# EAGLE design gate-controller-V2 (EAGLE 7.6.0)
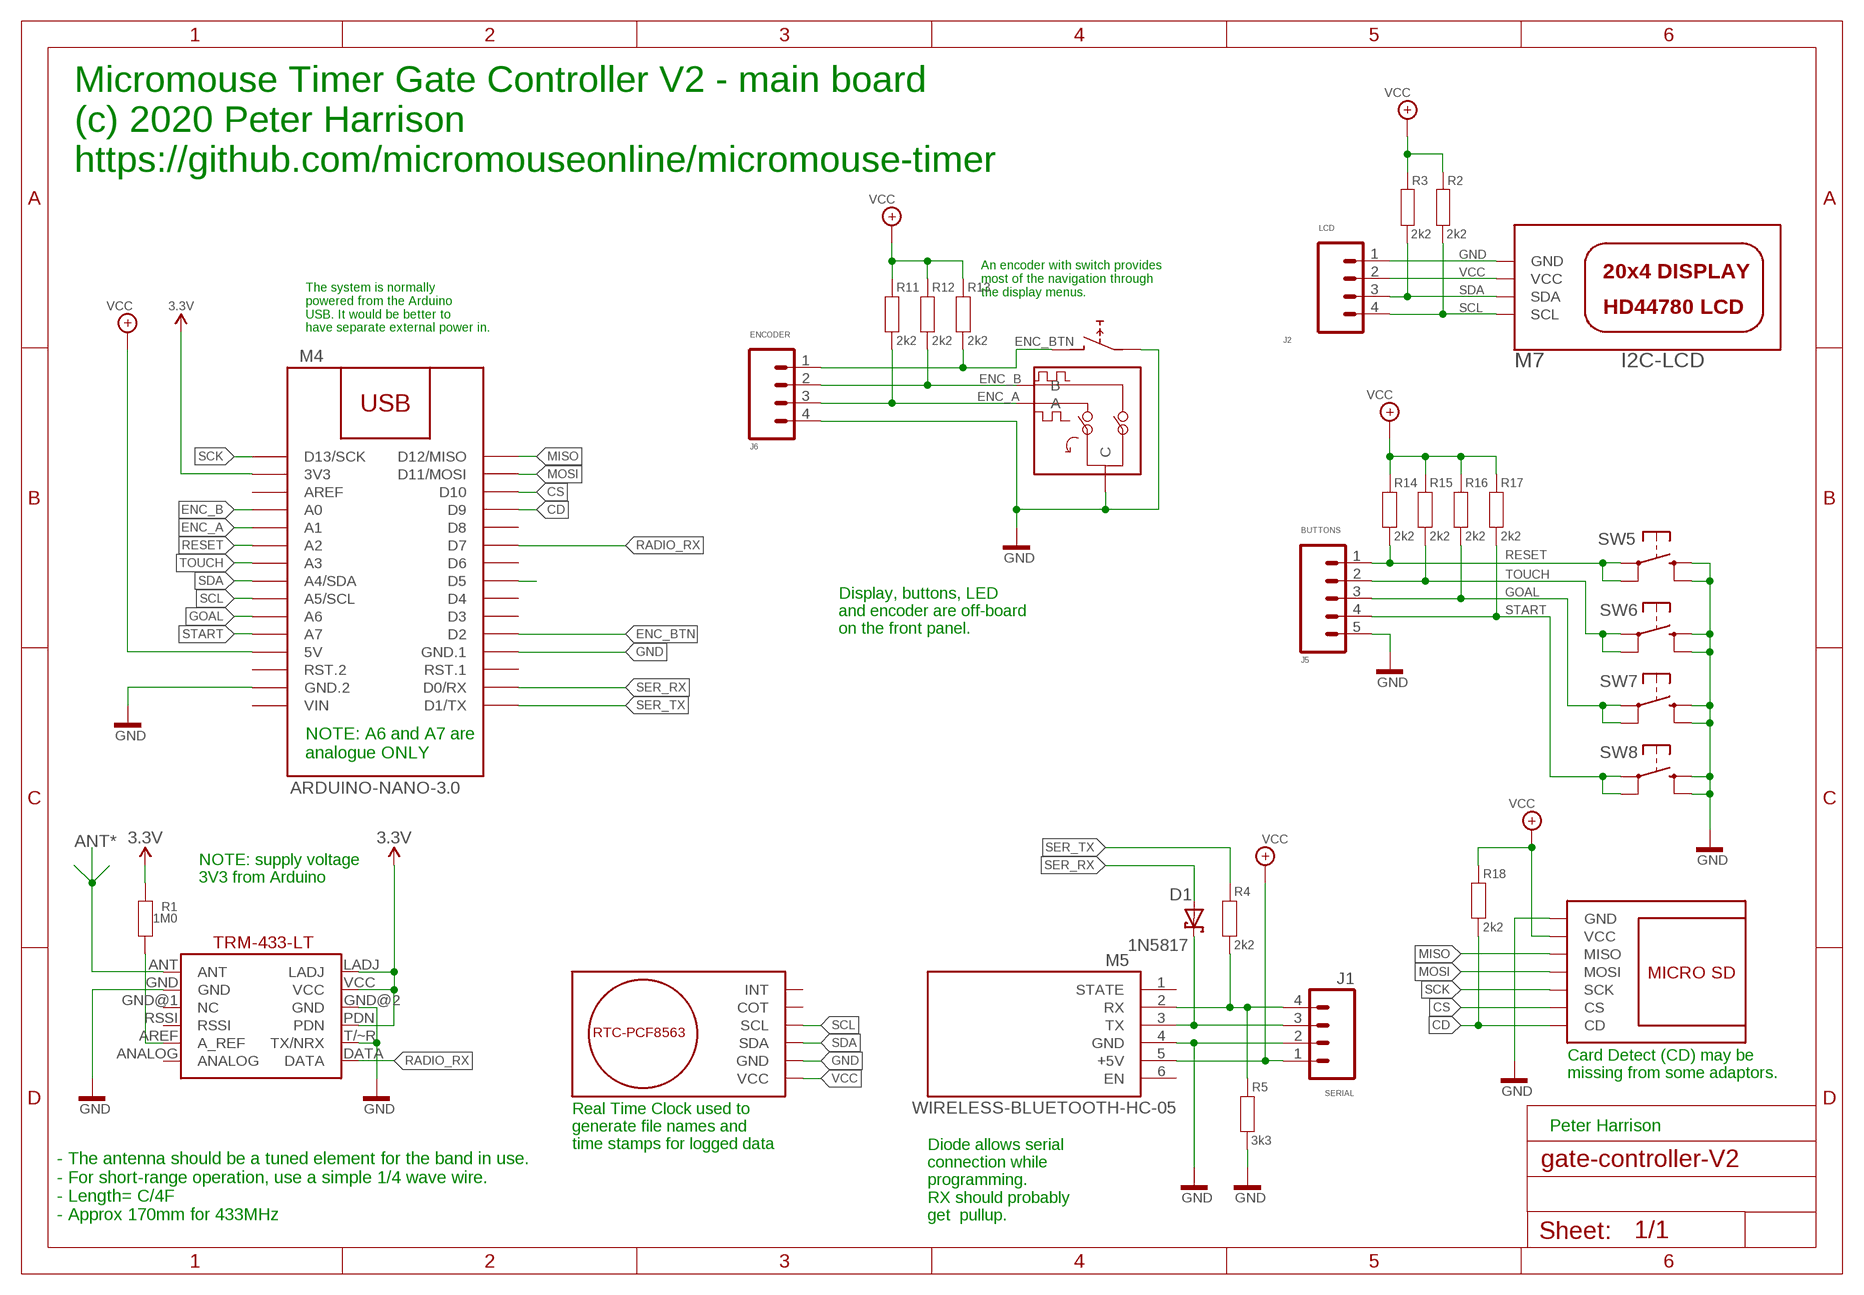
[diagram p0: schematic, sheet 1]
FRAME1 (A4L-LOC): NME: Peter Harrison

## Parts
D1  1N5817  SCHOTTKY-DIODEDO35-7  [DO35-7]
J1  SERIAL  M04PTH  [1X04]
J2  LCD  M04PTH  [1X04]
J5  BUTTONS  M05PTH  [1X05]
J6  ENCODER  M04PTH  [1X04]
M2  RTC-PCF8563  [RTC-PCF8563]
M3  TRM-433-LT  [LINX-TRM-433-LT]
M4  ARDUINO-NANO-3.0  [ARDUINO-NANO-3.0]
M5  WIRELESS-BLUETOOTH-HC-05  [WIRELESS-BLUETOOTH-HC-05]
M6  MICRO-SD-ADAPTOR  [MICRO-SD-ADAPTOR]
M7  I2C-LCD  (no package)
R1  1M0  RESISTOR_AXIAL-0207_0.4  [AXIAL-0207_0.4]
R2  2k2  RESISTOR_AXIAL-0207_0.4  [AXIAL-0207_0.4]
R3  2k2  RESISTOR_AXIAL-0207_0.4  [AXIAL-0207_0.4]
R4  2k2  RESISTOR_AXIAL-0207_0.4  [AXIAL-0207_0.4]
R5  3k3  RESISTOR_AXIAL-0207_0.4  [AXIAL-0207_0.4]
R11  2k2  RESISTOR_AXIAL-0207_0.4  [AXIAL-0207_0.4]
R12  2k2  RESISTOR_AXIAL-0207_0.4  [AXIAL-0207_0.4]
R13  2k2  RESISTOR_AXIAL-0207_0.4  [AXIAL-0207_0.4]
R14  2k2  RESISTOR_AXIAL-0207_0.4  [AXIAL-0207_0.4]
R15  2k2  RESISTOR_AXIAL-0207_0.4  [AXIAL-0207_0.4]
R16  2k2  RESISTOR_AXIAL-0207_0.4  [AXIAL-0207_0.4]
R17  2k2  RESISTOR_AXIAL-0207_0.4  [AXIAL-0207_0.4]
R18  2k2  RESISTOR_AXIAL-0207_0.4  [AXIAL-0207_0.4]
SW5  ARCADE_BUTTON_24MM  (no package)
SW6  ARCADE_BUTTON_24MM  (no package)
SW7  ARCADE_BUTTON_24MM  (no package)
SW8  ARCADE_BUTTON_24MM  (no package)
U$2  EC12_SW  (no package)

## Nets
3V3: M3.LADJ M3.PDN M3.VCC M4.3V3 R1.2 ; supply symbol labelled 3.3V
ANT*: M3.ANT
CD: M4.D9 M6.CD R18.1
CS: M4.D10 M6.CS
D5: M4.D5
ENC_A: J6.3 M4.A1 R11.1 U$2.A
ENC_B: J6.2 M4.A0 R12.1 U$2.B
ENC_BTN: J6.1 M4.D2 R13.1 U$2.E
GND: J1.2 J2.1 J5.5 J6.4 M2.GND M3.GND M3.GND@2(GND) M3.T/~R(TX/NRX) M4.GND@1(GND.2) M4.GND@2(GND.1) M5.4(GND) M6.GND M7.GND R5.1 SW5.3 SW5.4 SW6.3 SW6.4 SW7.3 SW7.4 SW8.3 SW8.4 U$2.C U$2.D
GOAL: J5.3 M4.A6 R16.1 SW7.1 SW7.2
MISO: M4.D12(D12/MISO) M6.MISO
MOSI: M4.D11(D11/MOSI) M6.MOSI
N$8: M3.AREF(A_REF) R1.1
N$14: J1.4 M5.2(RX) R4.1 R5.2
N$34: D1.C J1.3 M5.3(TX)
RADIO_RX: M3.DATA M4.D7
RESET: J5.1 M4.A2 R14.1 SW5.1 SW5.2
SCK: M4.D13(D13/SCK) M6.SCK
SCL: J2.4 M2.SCL M4.A5(A5/SCL) M7.SCL R2.1
SDA: J2.3 M2.SDA M4.A4(A4/SDA) M7.SDA R3.1
SER_RX: D1.A M4.RX0(D0/RX)
SER_TX: M4.TX1(D1/TX) R4.2
START: J5.4 M4.A7 R17.1 SW8.1 SW8.2
TOUCH: J5.2 M4.A3 R15.1 SW6.1 SW6.2
VCC: J1.1 J2.2 M2.VCC M4.5V M5.5(+5V) M6.VCC M7.VCC R2.2 R3.2 R11.2 R12.2 R13.2 R14.2 R15.2 R16.2 R17.2 R18.2
Unconnected: M2.COT M2.INT M3.ANALOG M3.GND@1(NC) M3.RSSI M4.AREF M4.D3 M4.D4 M4.D6 M4.D8 M4.RST@1(RST.2) M4.RST@2(RST.1) M5.1(STATE) M5.6(EN)

## Notes on the sheet
- Micromouse Timer Gate Controller V2 - main board
  (c) 2020 Peter Harrison
  https://github.com/micromouseonline/micromouse-timer
- An encoder with switch provides 
  most of the navigation through 
  the display menus.
- The system is normally 
  powered from the Arduino 
  USB. It would be better to 
  have separate external power in.
- Display, buttons, LED
  and encoder are off-board
  on the front panel.
- NOTE: A6 and A7 are
  analogue ONLY
- NOTE: supply voltage 
  3V3 from Arduino
- Card Detect (CD) may be 
  missing from some adaptors.
- Real Time Clock used to
  generate file names and
  time stamps for logged data
- - The antenna should be a tuned element for the band in use.
  - For short-range operation, use a simple 1/4 wave wire.
  - Length= C/4F
  - Approx 170mm for 433MHz
- Diode allows serial 
  connection while 
  programming.
  RX should probably 
  get  pullup.

## Power pins joined to a net without a drawn wire
VIN: M4.VIN

## Library data of the parts
D1 = micromouse-timer:SCHOTTKY-DIODE: Schottky Diode
J1 J2 J6 = micromouse-timer:M04: Header 4 Standard 4-pin 0.1" header. Use with straight break away headers (SKU : PRT-00116), right angle break away headers (PRT-00553), swiss pins (PRT-00743), machine pins (PRT-00117), and female headers (PRT-00115). Molex polarized connector foot print use with SKU : PRT-08231 with associated crimp pins and housings. 1MM SMD Version SKU: PRT-10208
J5 = micromouse-timer:M05: Header 5 Standard 5-pin 0.1" header. Use with straight break away headers (SKU : PRT-00116), right angle break away headers (PRT-00553), swiss pins (PRT-00743), machine pins (PRT-00117), and female headers (PRT-00115). Molex polarized connector foot print use with SKU : PRT-08230 with associated crimp pins and housings.
M2 = micromouse-timer:RTC-PCF8563
M3 = micromouse-timer:TRM-433-LT: LINX 433 MHz Tranceiver
M4 = micromouse-timer:ARDUINO-NANO-3.0: Arduino Nano 3.0 and compatible devices More details available here: https://www.arduino.cc/en/Main/ArduinoBoardNano Click here to find device on ebay.com <http://www.ebay.com/sch/arduino+nano>
M5 = micromouse-timer:WIRELESS-BLUETOOTH-HC-05: Bluetooth Transceiver Module based on HC-05 board Tutorial is available here: https://arduino-info.wikispaces.com/BlueTooth-HC05-HC06-Modules-How-To Click here to find device on ebay.com <http://www.ebay.com/sch/hc-05+module+rs232>
M6 = micromouse-timer:MICRO-SD-ADAPTOR
M7 = micromouse-timer:I2C-LCD
R1-R5 R11-R18 = micromouse-timer:RESISTOR_: Resistor Basic schematic elements and footprints for 0603, 1206, and PTH 1/10th watt (small) resistors.
SW5-SW8 = micromouse-timer:ARCADE_BUTTON_24MM
U$2 = micromouse-timer:EC12_SW

## Net classes
0 default: width 0.762 mm, drill 0.8 mm, clearance 0.25 mm

## Board
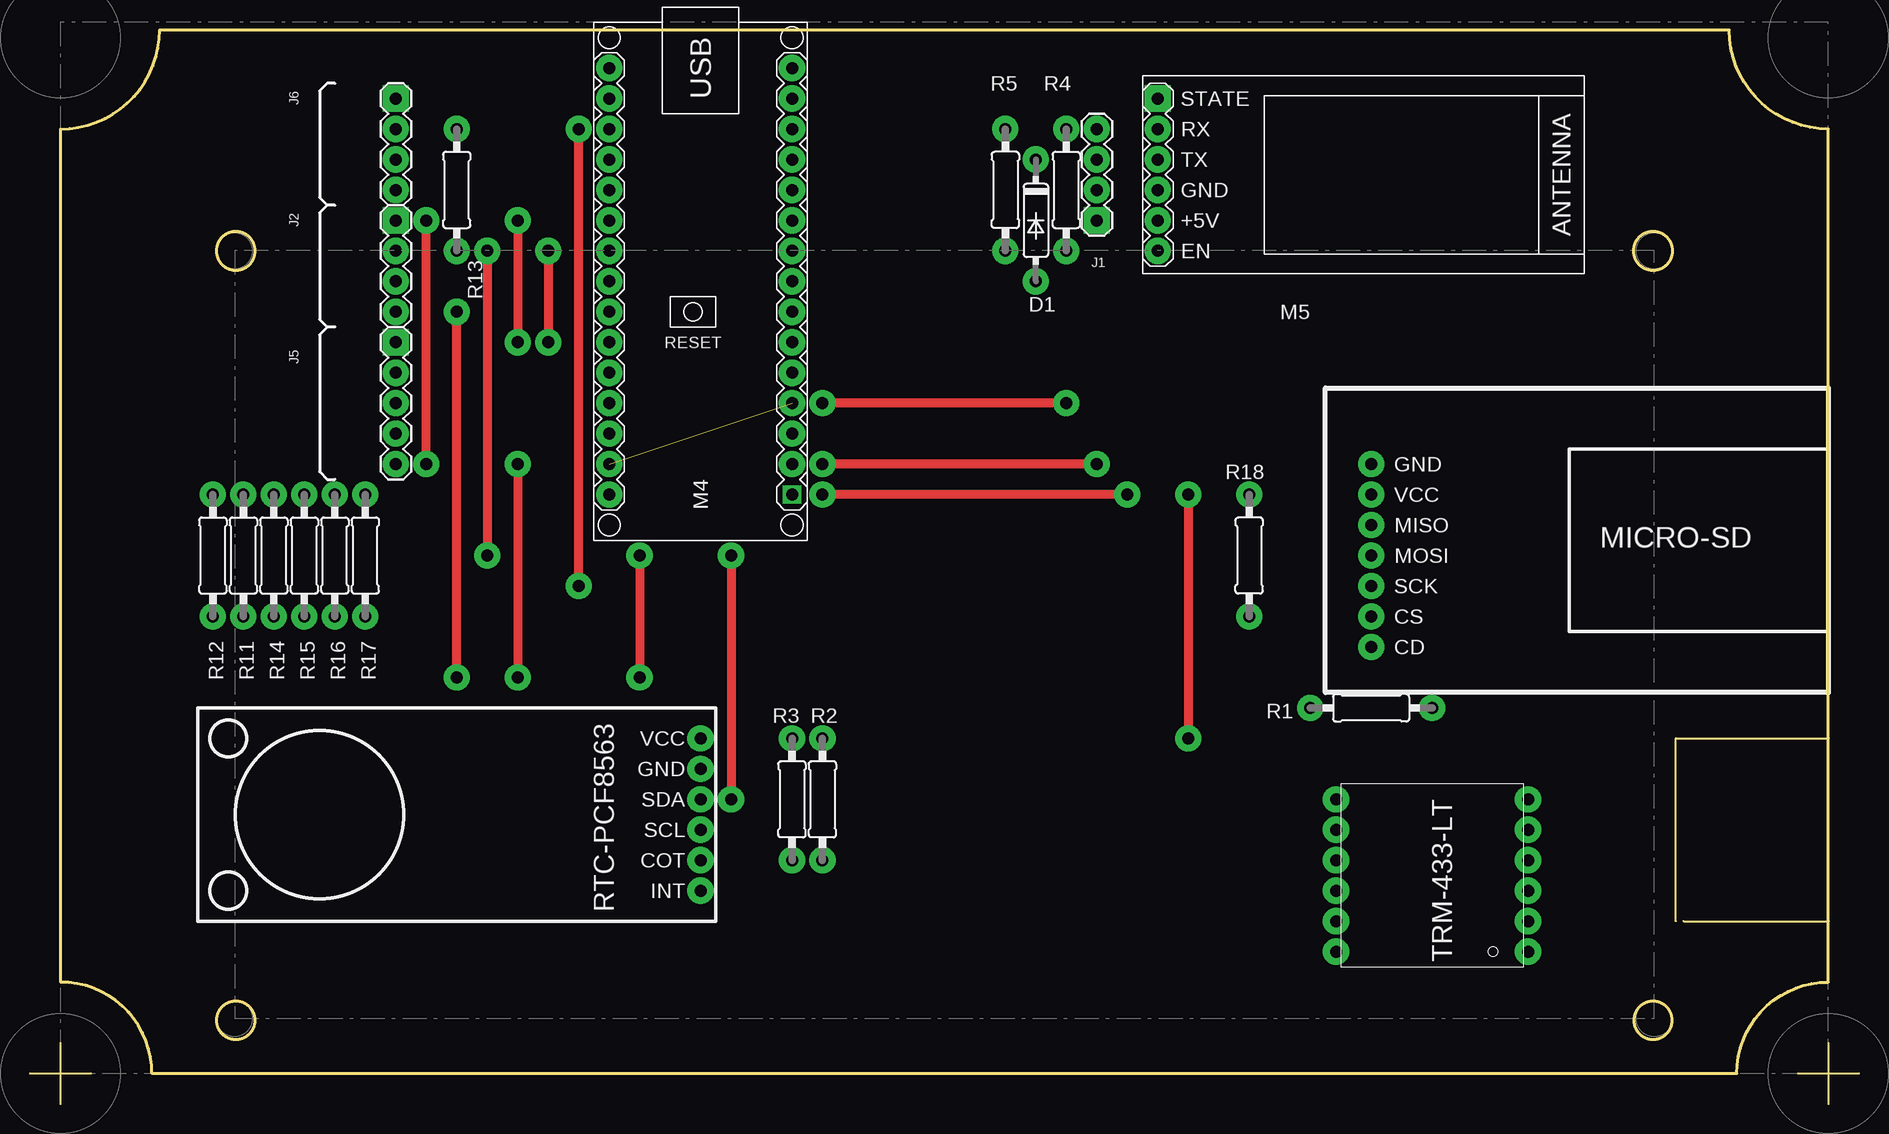
[diagram p1: board, top side]
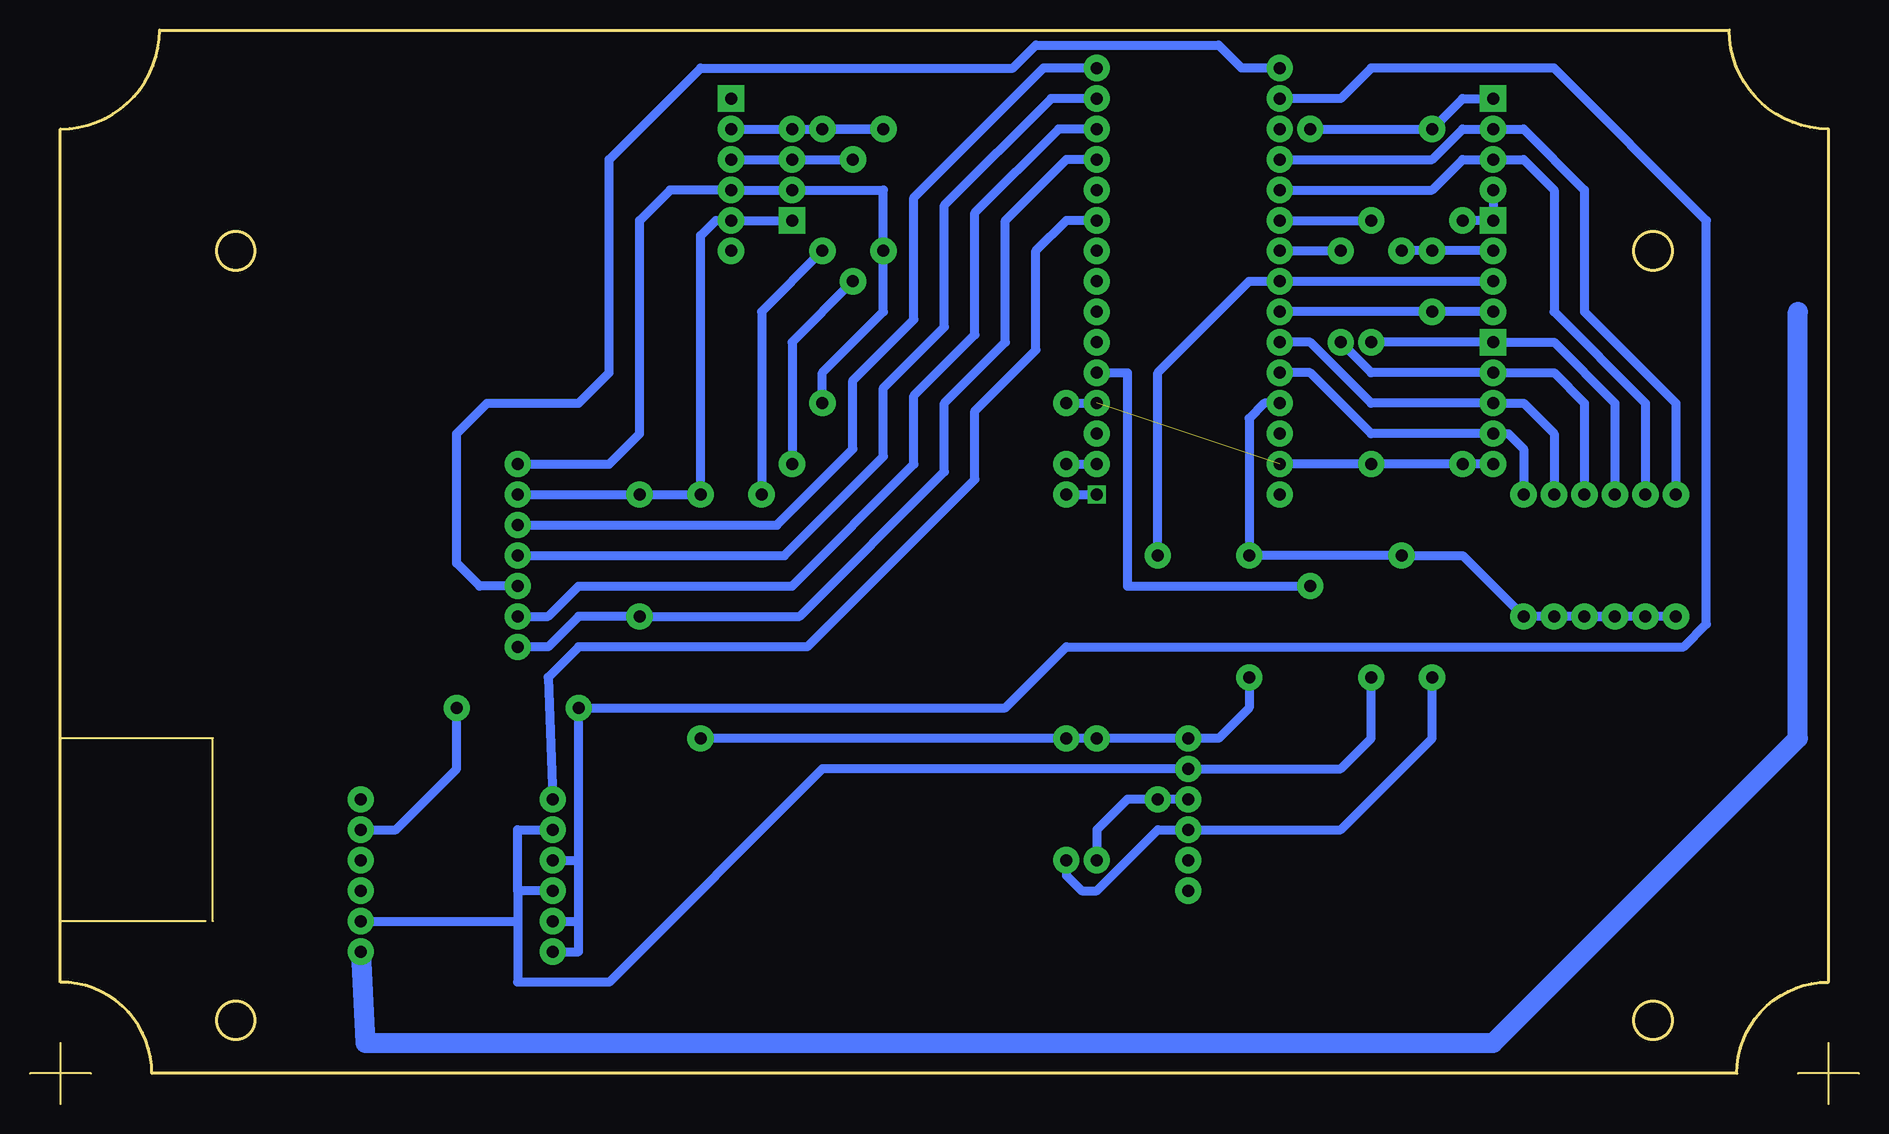
[diagram p2: board, bottom side, seen from below]

Size 152.4 x 89.54 mm. Coordinates in mm from the lower left corner, seen from the top.
Outline: 149.86,15.24 149.86,10.16 arc90 142.24,2.54 10.16,2.54 arc90 2.54,10.16 2.54,81.28 arc90 10.8,89.54 141.6,89.54 arc90 149.86,81.28 149.86,30.48
Outline: 149.86,15.24 149.86,30.48
Outline: 137.16,15.24 137.16,30.48 149.86,30.48
Outline: 137.79,15.24 149.86,15.24
Outline: 147.32,2.54 152.4,2.54
Outline: 149.86,5.08 149.86,0
Outline: 0,2.54 5.08,2.54
Outline: 2.54,5.08 2.54,0
Outline: circle at 17.14,71.12 radius 1.59
Outline: circle at 17.14,6.99 radius 1.59
Outline: circle at 135.25,6.99 radius 1.57
Outline: circle at 135.25,71.12 radius 1.59
Copper layers (1*16): Top 0.035mm / dielectric 1.5mm / Bottom 0.035mm
Design rules "OthermillDRC_30_deg_v2 *": minimum track width 30mil, minimum drill 0.8mm, track to track 6mil, track to pad 6mil, pad to pad 6mil, via to via 6mil, smd to smd 0mil, copper to edge 0.25mm, drill to drill 6mil, minimum pad ring 10mil, minimum via ring 10mil, stop-mask expansion 1mil, vias tented up to drill 30mil, thermal gap 6mil

### Footprints (pad centres in the part's own frame; a part is rotated, then mirrored left to right if it is on the bottom)
DO35-7 = drill 1 pad 2.184: A 5.08,0; C -5.08,0
1X04 = drill 1 pad 2.184 square: 1 0,0 | drill 1 pad 2.184: 2 2.54,0; 3 5.08,0; 4 7.62,0
1X05 = drill 1 pad 2.184 square: 1 0,0 | drill 1 pad 2.184: 2 2.54,0; 3 5.08,0; 4 7.62,0; 5 10.16,0
RTC-PCF8563 = drill 1 pad 2.184: COT 1.27,3.81; GND 1.27,-3.81; INT 1.27,6.35; SCL 1.27,1.27; SDA 1.27,-1.27; VCC 1.27,-6.35
LINX-TRM-433-LT = drill 1 pad 2.184: ANALOG -8,-5.08; ANT -8,7.62; AREF -8,-2.54; DATA 8,-5.08; GND -8,5.08; GND@1 -8,2.54; GND@2 8,2.54; LADJ 8,7.62; PDN 8,0; RSSI -8,0; T/~R 8,-2.54; VCC 8,5.08
ARDUINO-NANO-3.0 = drill 1 pad 2.184: 3V3 -15.24,-7.62; 5V 10.16,-7.62; A0 -10.16,-7.62; A1 -7.62,-7.62; A2 -5.08,-7.62; A3 -2.54,-7.62; A4 0,-7.62; A5 2.54,-7.62; A6 5.08,-7.62; A7 7.62,-7.62; AREF -12.7,-7.62; D2 7.62,7.62; D3 5.08,7.62; D4 2.54,7.62; D5 0,7.62; D6 -2.54,7.62; D7 -5.08,7.62; D8 -7.62,7.62; D9 -10.16,7.62; D10 -12.7,7.62; D11 -15.24,7.62; D12 -17.78,7.62; D13 -17.78,-7.62; GND@1 15.24,-7.62; GND@2 10.16,7.62; RST@1 12.7,-7.62; RST@2 12.7,7.62; RX0 15.24,7.62; VIN 17.78,-7.62 | drill 1 square: TX1 17.78,7.62
WIRELESS-BLUETOOTH-HC-05 = drill 1 pad 2.184 square: 1 -6.35,-17.145 | drill 1 pad 2.184: 2 -3.81,-17.145; 3 -1.27,-17.145; 4 1.27,-17.145; 5 3.81,-17.145; 6 6.35,-17.145
MICRO-SD-ADAPTOR = drill 1 pad 2.184: CD -7.62,-8.89; CS -7.62,-6.35; GND -7.62,6.35; MISO -7.62,1.27; MOSI -7.62,-1.27; SCK -7.62,-3.81; VCC -7.62,3.81
AXIAL-0207_0.4 = drill 1 pad 2.184: 1 -5.08,0; 2 5.08,0

### Placement (x,y rotation side)
D1  83.82,73.66 270 top
J1  88.9,73.66 90 top
J2  30.48,73.66 270 top
J5  30.48,63.5 270 top
J6  30.48,83.82 270 top
M2  57.15,24.13 180 top
M3  116.84,20.32 180 top
M4  55.88,68.58 270 top
M5  111.12,77.47 270 top
M6  119.38,46.99 0 top
R1  111.76,33.02 180 top
R2  66.04,25.4 90 top
R3  63.5,25.4 90 top
R4  86.36,76.2 270 top
R5  81.28,76.2 90 top
R11  17.78,45.72 270 top
R12  15.24,45.72 270 top
R13  35.56,76.2 270 top
R14  20.32,45.72 270 top
R15  22.86,45.72 270 top
R16  25.4,45.72 270 top
R17  27.94,45.72 270 top
R18  101.6,45.72 90 top
U$1  [HAMMOND-1595-C-BOARD]  76.2,34.29 0 top

### Tracks (layer width: path | path; a pad name or v marks a point on that pad's centre or on a via)
3V3
  Bottom 0.762: M3.PDN 106.68,20.32 | 106.68,20.32 R1.2 71.12,33.02 66.04,38.1 14.61,38.1 12.7,40.01 12.7,73.66 25.4,86.36 40.64,86.36 43.18,83.82 M4.3V3 | M3.VCC 106.68,15.24 | 106.68,15.24 106.68,20.32 | M3.LADJ 106.68,12.7 106.68,15.24
ANT*
  Bottom 1.676: M3.ANT 124.46,5.08 30.48,5.08 5.08,30.48 5.08,66.04
CD
  Bottom 0.762: M4.D9 66.04,78.74 71.12,73.66 71.12,63.5 76.2,58.42 76.2,52.7 88.27,40.64 R18.1 106.68,40.64 109.22,38.1 M6.CD
CS
  Bottom 0.762: M4.D10 66.68,81.28 73.66,74.3 73.66,64.14 78.74,59.05 78.74,53.34 88.9,43.18 106.68,43.18 109.22,40.64 M6.CS
ENC_A
  Bottom 0.762: R11.1 17.78,58.42 25.4,66.04 25.4,76.2 27.94,78.74 J6.3 33.02,78.74 35.56,76.2 M4.A1
ENC_B
  Bottom 0.762: R12.1 15.24,58.42 22.86,66.04 22.86,76.2 27.94,81.28 J6.2 33.02,81.28 35.56,78.74 M4.A0
ENC_BTN  (via drill 1 pad 2.18)
  Top 0.762: v45.72,43.18 v45.72,81.28
  Bottom 0.762: M4.D2 60.96,60.96 60.96,43.18 v45.72,43.18 | v45.72,81.28 R13.1 33.02,83.82 J6.1
GND  (via drill 1 pad 2.18)  (1 unrouted)
  Top 0.762: v33.02,53.34 v33.02,73.66 | v86.36,58.42 v66.04,58.42 | v40.64,53.34 v40.64,35.56
  Bottom 0.762: v33.02,73.66 J2.1 J6.4 | v86.36,58.42 86.36,60.96 81.28,66.04 R5.1 81.28,76.2 M5.4 | M5.4 J1.2 | M3.GND@2 111.76,17.78 | 111.76,17.78 111.76,22.86 M3.T/~R | 111.76,17.78 111.76,15.24 | 111.76,15.24 111.76,10.16 104.14,10.16 86.36,27.94 M2.GND 43.18,27.94 40.64,30.48 v40.64,35.56 | J5.5 v33.02,53.34 v40.64,53.34 M4.GND@1 | v66.04,58.42 M4.GND@2 | M3.GND 111.76,15.24 | M5.4 99.06,76.2 101.6,73.66 101.6,55.88 104.14,53.34 M6.GND
GOAL
  Bottom 0.762: M4.A6 45.72,63.5 40.64,58.42 J5.3 27.94,58.42 25.4,55.88 R16.1
MISO
  Bottom 0.762: M4.D12 67.95,86.36 78.74,75.57 78.74,65.41 83.82,60.32 83.82,54.61 90.17,48.26 M6.MISO
MOSI
  Bottom 0.762: M4.D11 67.31,83.82 76.2,74.93 76.2,64.77 81.28,59.69 81.28,53.98 89.54,45.72 M6.MOSI
N$8
  Bottom 0.762: M3.AREF 121.92,22.86 116.84,27.94 R1.1
N$14
  Bottom 0.762: R4.1 R5.2 M5.2 J1.4
N$34
  Bottom 0.762: J1.3 M5.3 D1.C
RADIO_RX
  Bottom 0.762: M4.D7 66.04,73.66 68.58,71.12 68.58,62.87 73.66,57.78 73.66,52.07 87.63,38.1 106.68,38.1 109.22,35.56 M3.DATA
RESET  (via drill 1 pad 2.18)
  Top 0.762: v40.64,73.66 v40.64,63.5
  Bottom 0.762: v40.64,63.5 J5.1 25.4,63.5 20.32,58.42 R14.1 | M4.A2 v40.64,73.66
SCK
  Bottom 0.762: M4.D13 51.44,86.36 53.34,88.27 68.58,88.27 70.48,86.36 96.52,86.36 104.14,78.74 104.14,60.96 106.68,58.42 114.3,58.42 116.84,55.88 116.84,45.09 114.94,43.18 M6.SCK
SCL  (via drill 1 pad 2.18)
  Top 0.762: v35.56,35.56 v35.56,66.04
  Bottom 0.762: J2.4 v35.56,66.04 M4.A5 | v35.56,35.56 35.56,30.48 43.18,22.86 M2.SCL 58.42,22.86 63.5,17.78 64.77,17.78 66.04,19.05 R2.1
SDA  (via drill 1 pad 2.18)
  Top 0.762: v58.42,45.72 v58.42,25.4
  Bottom 0.762: J2.3 M4.A4 50.8,68.58 58.42,60.96 v58.42,45.72 | M2.SDA v58.42,25.4 60.96,25.4 63.5,22.86 R3.1
SER_RX  (via drill 1 pad 2.18)
  Top 0.762: v88.9,53.34 v66.04,53.34
  Bottom 0.762: v66.04,53.34 M4.RX0 | D1.A 88.9,63.5 v88.9,53.34
SER_TX  (via drill 1 pad 2.18)
  Top 0.762: v91.44,50.8 v66.04,50.8
  Bottom 0.762: v66.04,50.8 M4.TX1 | R4.2 91.44,66.04 v91.44,50.8
START
  Bottom 0.762: M4.A7 45.72,60.96 40.64,55.88 J5.4 29.21,55.88 27.94,54.61 R17.1
TOUCH  (via drill 1 pad 2.18)
  Top 0.762: v43.18,71.12 v43.18,63.5
  Bottom 0.762: v43.18,63.5 40.64,60.96 J5.2 25.4,60.96 22.86,58.42 R15.1 | M4.A3 v43.18,71.12
VCC  (via drill 1 pad 2.18)
  Top 0.762: v96.52,50.8 v96.52,30.48 | v38.1,71.12 v38.1,45.72 | v50.8,45.72 v50.8,35.56
  Bottom 0.762: R12.2 R11.2 R15.2 R14.2 R16.2 R17.2 33.02,45.72 v38.1,45.72 v50.8,45.72 50.8,57.15 49.53,58.42 M4.5V | J1.1 M5.5 95.25,73.66 96.52,72.39 v96.52,50.8 R18.2 M6.VCC | J2.2 R13.2 v38.1,71.12 | v50.8,35.56 50.8,33.02 53.34,30.48 M2.VCC R3.2 R2.2 v96.52,30.48

### Text on the board
tValues: BTN | ENC_B | ENC_A | GND | GND | VCC | SDA | SCL | CLEAR | TOUCH | GOAL | START | GND | MICROMOUSE TIMER V2 / P Harrison 2020